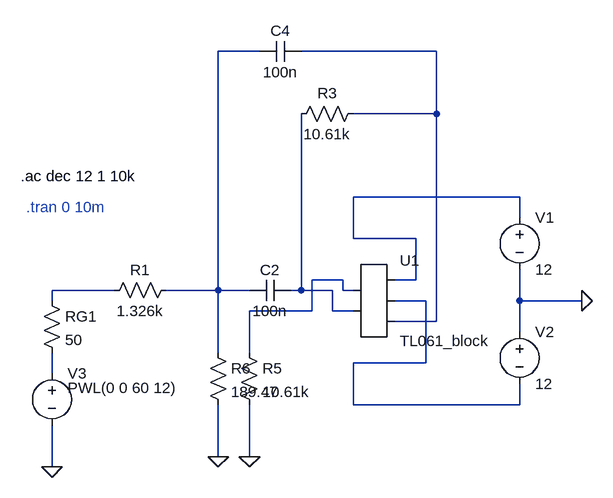
[diagram p0: schematic dalyiannis-friend-filter.asc]
dalyiannis-friend-filter.asc, the LTspice schematic file:
Version 4
SHEET 1 880 680
WIRE 368 -64 304 -64
WIRE 640 -64 432 -64
WIRE 640 32 640 -64
WIRE 640 32 512 32
WIRE 768 160 512 160
WIRE 768 192 768 160
WIRE 512 224 512 160
WIRE 608 224 512 224
WIRE 496 288 448 288
WIRE 608 288 608 224
WIRE 608 288 576 288
WIRE 144 304 48 304
WIRE 304 304 304 -64
WIRE 304 304 224 304
WIRE 352 304 304 304
WIRE 432 304 432 32
WIRE 432 304 416 304
WIRE 480 304 432 304
WIRE 496 304 496 288
WIRE 512 304 496 304
WIRE 48 320 48 304
WIRE 624 320 576 320
WIRE 768 320 768 272
WIRE 864 320 768 320
WIRE 448 336 448 288
WIRE 448 336 352 336
WIRE 480 336 480 304
WIRE 512 336 480 336
WIRE 640 352 640 32
WIRE 640 352 576 352
WIRE 768 368 768 320
WIRE 304 400 304 304
WIRE 352 400 352 336
WIRE 624 416 624 320
WIRE 624 416 512 416
WIRE 48 432 48 400
WIRE 512 480 512 416
WIRE 768 480 768 448
WIRE 768 480 512 480
WIRE 304 560 304 480
WIRE 352 560 352 480
WIRE 48 576 48 512
FLAG 864 320 0
FLAG 48 576 0
FLAG 352 560 0
FLAG 304 560 0
SYMBOL res 528 16 R90
WINDOW 0 0 56 VBottom 2
WINDOW 3 32 56 VTop 2
SYMATTR InstName R3
SYMATTR Value 10.61k
SYMBOL res 240 288 R90
WINDOW 0 0 56 VBottom 2
WINDOW 3 32 56 VTop 2
SYMATTR InstName R1
SYMATTR Value 1.326k
SYMBOL voltage 768 176 R0
SYMATTR InstName V1
SYMATTR Value 12
SYMBOL voltage 768 352 R0
SYMATTR InstName V2
SYMATTR Value 12
SYMBOL res 336 384 R0
SYMATTR InstName R5
SYMATTR Value 10.61k
SYMBOL res 32 304 R0
SYMATTR InstName RG1
SYMATTR Value 50
SYMBOL AutoGenerated/TL061_block 544 320 R0
SYMATTR InstName U1
SYMBOL cap 416 288 R90
WINDOW 0 0 32 VBottom 2
WINDOW 3 32 32 VTop 2
SYMATTR InstName C2
SYMATTR Value 100n
SYMBOL cap 432 -80 R90
WINDOW 0 0 32 VBottom 2
WINDOW 3 32 32 VTop 2
SYMATTR InstName C4
SYMATTR Value 100n
SYMBOL res 288 384 R0
SYMATTR InstName R6
SYMATTR Value 189.47
SYMBOL voltage 48 416 R0
WINDOW 3 24 38 Left 2
SYMATTR Value PWL(0 0 60 12)
SYMATTR InstName V3
SYMATTR Value2 AC 12
TEXT 0 128 Left 2 !.ac dec 12 1 10k
TEXT 8 176 Left 2 ;.tran 0 10m

The netlist it stands for:
* dalyiannis-friend-filter.asc
R3 N002 N006 10.61k
R1 N001 N005 1.326k
V1 N003 0 12
V2 0 N007 12
R5 N004 0 10.61k
RG1 N005 N008 50
* U1: TL061_block (symbol AutoGenerated/TL061_block not available, pins judged from their places): pin1=N004 pin2=N006 pin3=N003 pin4=N007 pin5=N002
C2 N006 N001 100n
C4 N002 N001 100n
R6 N001 0 189.47
V3 N008 0 PWL(0 0 60 12) AC 12
.ac dec 12 1 10k
* .tran 0 10m
.backanno
.end